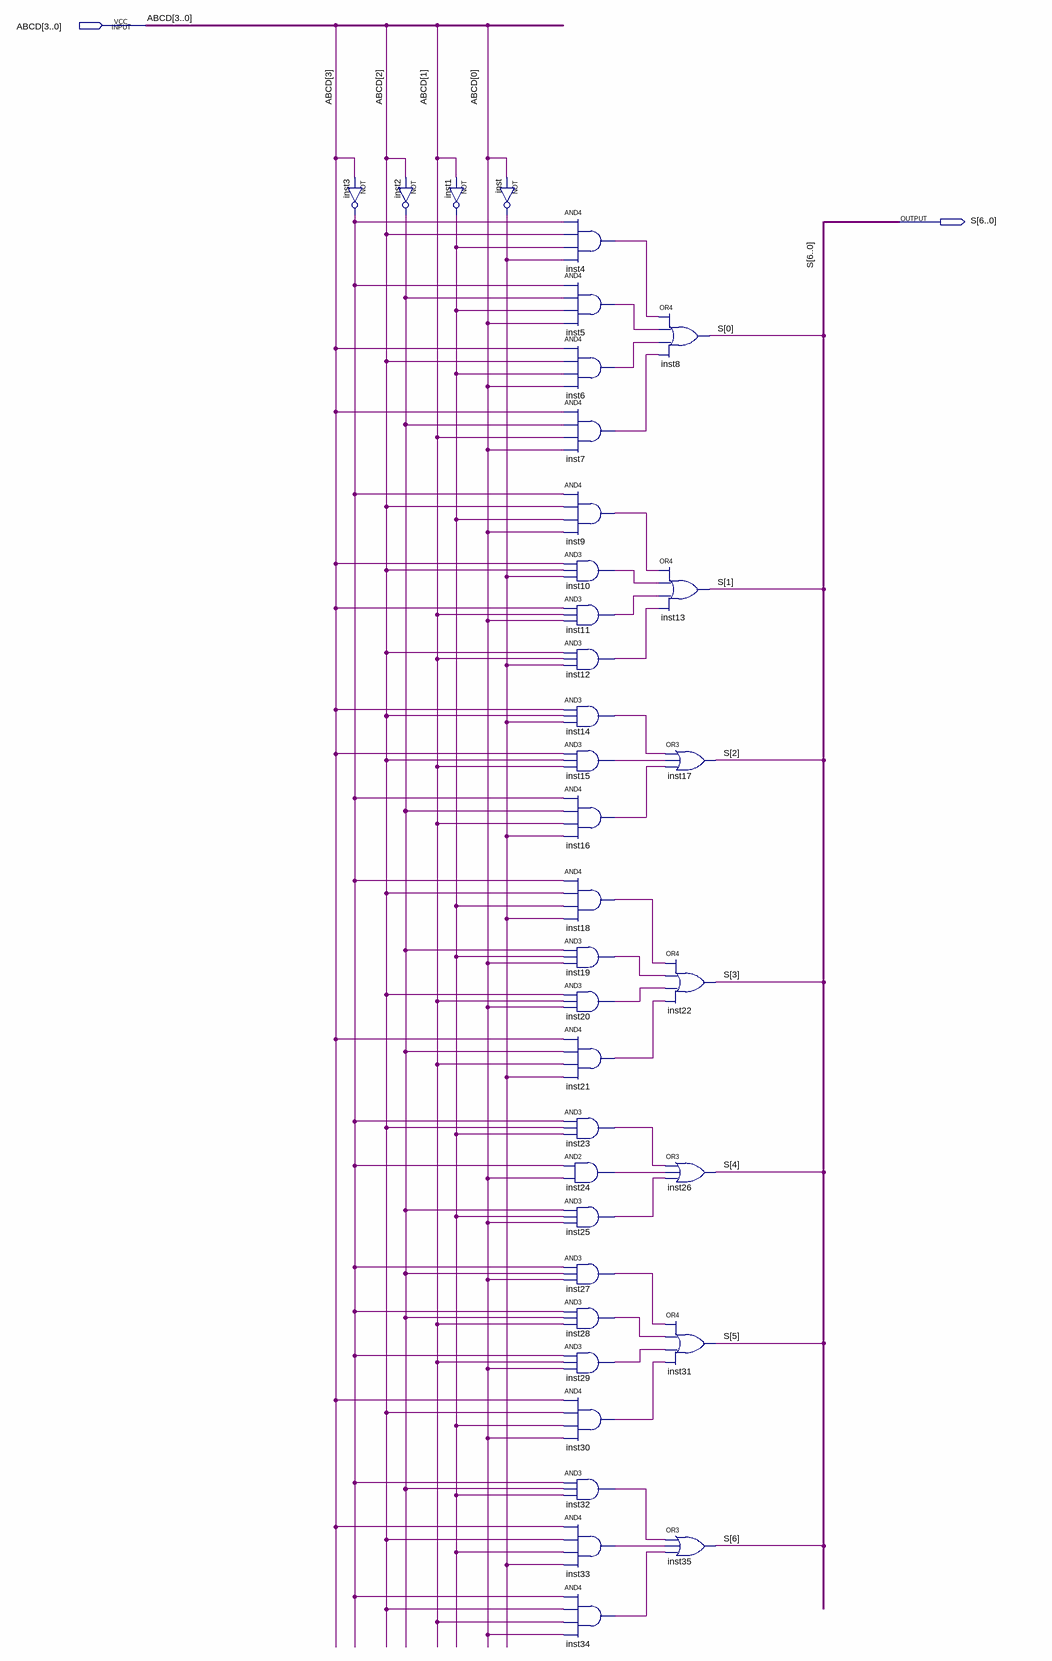
[diagram p0: schematic sheet]
// Quartus schematic lab2_decodificadorB.bdf as structural Verilog: 36 symbols, 2 pins
module lab2_decodificadorB (
  input  [3:0] ABCD,
  output [6:0] S
);

  wire inst1_out, inst2_out, inst3_out, inst4_out, inst5_out, inst6_out, inst7_out, inst9_out, inst10_out,
       inst11_out, inst12_out, inst14_out, inst15_out, inst16_out, inst18_out, inst19_out, inst20_out,
       inst21_out, inst23_out, inst24_out, inst25_out, inst27_out, inst28_out, inst29_out, inst30_out,
       inst32_out, inst33_out, inst34_out, inst_out;

  not inst3 (inst3_out, ABCD[3]);
  not inst2 (inst2_out, ABCD[2]);
  not inst1 (inst1_out, ABCD[1]);
  not inst (inst_out, ABCD[0]);
  and inst4 (inst4_out, inst3_out, ABCD[2], inst1_out, inst_out);
  and inst5 (inst5_out, inst3_out, inst2_out, inst1_out, ABCD[0]);
  and inst6 (inst6_out, ABCD[3], ABCD[2], inst1_out, ABCD[0]);
  and inst7 (inst7_out, ABCD[3], inst2_out, ABCD[1], ABCD[0]);
  and inst9 (inst9_out, inst3_out, ABCD[2], inst1_out, ABCD[0]);
  and inst10 (inst10_out, ABCD[3], ABCD[2], inst_out);
  and inst11 (inst11_out, ABCD[3], ABCD[1], ABCD[0]);
  and inst12 (inst12_out, ABCD[2], ABCD[1], inst_out);
  and inst14 (inst14_out, ABCD[3], ABCD[2], inst_out);
  and inst15 (inst15_out, ABCD[3], ABCD[2], ABCD[1]);
  and inst16 (inst16_out, inst3_out, inst2_out, ABCD[1], inst_out);
  and inst18 (inst18_out, inst3_out, ABCD[2], inst1_out, inst_out);
  and inst19 (inst19_out, inst2_out, inst1_out, ABCD[0]);
  and inst20 (inst20_out, ABCD[2], ABCD[1], ABCD[0]);
  and inst21 (inst21_out, ABCD[3], inst2_out, ABCD[1], inst_out);
  and inst23 (inst23_out, inst3_out, ABCD[2], inst1_out);
  and inst24 (inst24_out, inst3_out, ABCD[0]);
  and inst25 (inst25_out, inst2_out, inst1_out, ABCD[0]);
  and inst27 (inst27_out, inst3_out, inst2_out, ABCD[0]);
  and inst28 (inst28_out, inst3_out, inst2_out, ABCD[1]);
  and inst29 (inst29_out, inst3_out, ABCD[1], ABCD[0]);
  and inst30 (inst30_out, ABCD[3], ABCD[2], inst1_out, ABCD[0]);
  and inst32 (inst32_out, inst3_out, inst2_out, inst1_out);
  and inst33 (inst33_out, ABCD[3], ABCD[2], inst1_out, inst_out);
  and inst34 (inst34_out, inst3_out, ABCD[2], ABCD[1], ABCD[0]);
  or inst8 (S[0], inst4_out, inst5_out, inst6_out, inst7_out);
  or inst13 (S[1], inst9_out, inst10_out, inst11_out, inst12_out);
  or inst17 (S[2], inst14_out, inst15_out, inst16_out);
  or inst22 (S[3], inst18_out, inst19_out, inst20_out, inst21_out);
  or inst26 (S[4], inst23_out, inst24_out, inst25_out);
  or inst31 (S[5], inst27_out, inst28_out, inst29_out, inst30_out);
  or inst35 (S[6], inst32_out, inst33_out, inst34_out);
endmodule
